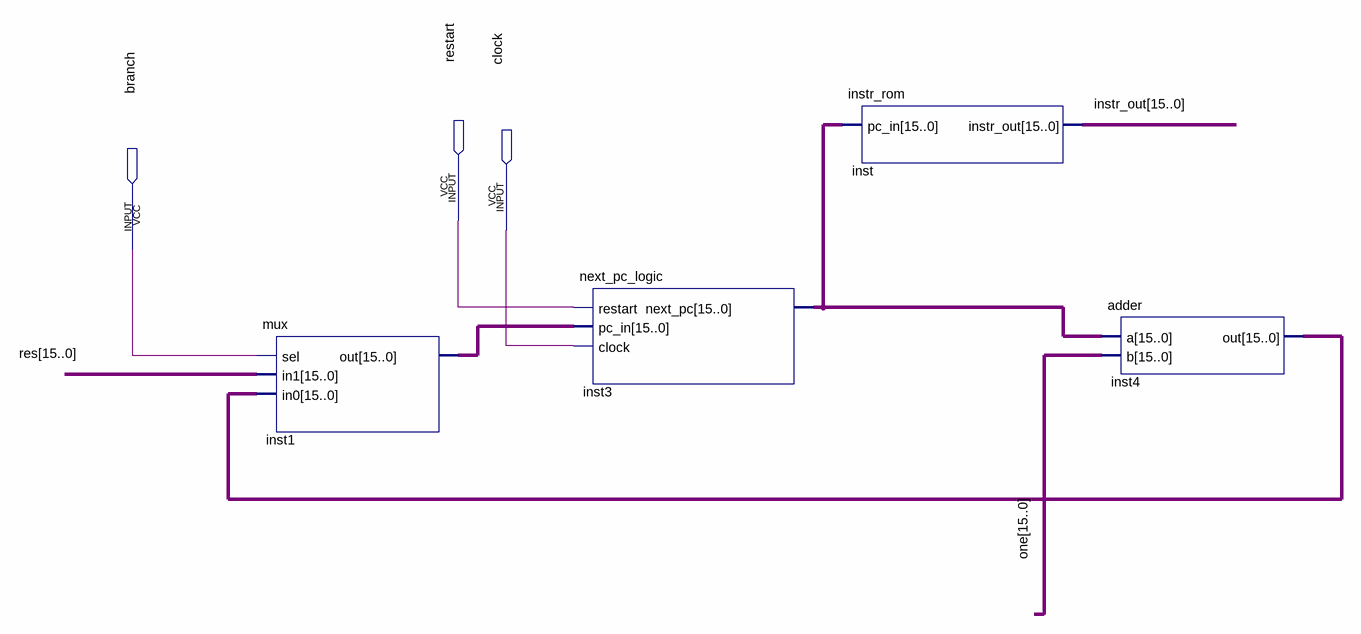
[diagram p0: schematic sheet]
// Quartus schematic fetch_unit.bdf as structural Verilog: 4 symbols, 3 pins
module fetch_unit (
  input  restart,
  input  clock,
  input  branch
);

  wire [15:0] inst1_out, inst3_next_pc, inst4_out, instr_out, one, res;

  mux inst1 (.sel(branch), .in1(res), .in0(inst4_out), .out(inst1_out));
  next_pc_logic inst3 (.restart(restart), .pc_in(inst1_out), .clock(clock), .next_pc(inst3_next_pc));
  instr_rom inst (.pc_in(inst3_next_pc), .instr_out(instr_out));
  adder inst4 (.a(inst3_next_pc), .b(one), .out(inst4_out));
endmodule
